# Altium schematic sheet 5v.SchDoc: Fuente Lineal 5v 10A
size A4; DrawnBy: Erick; Organization: ESIME; Revision: 1
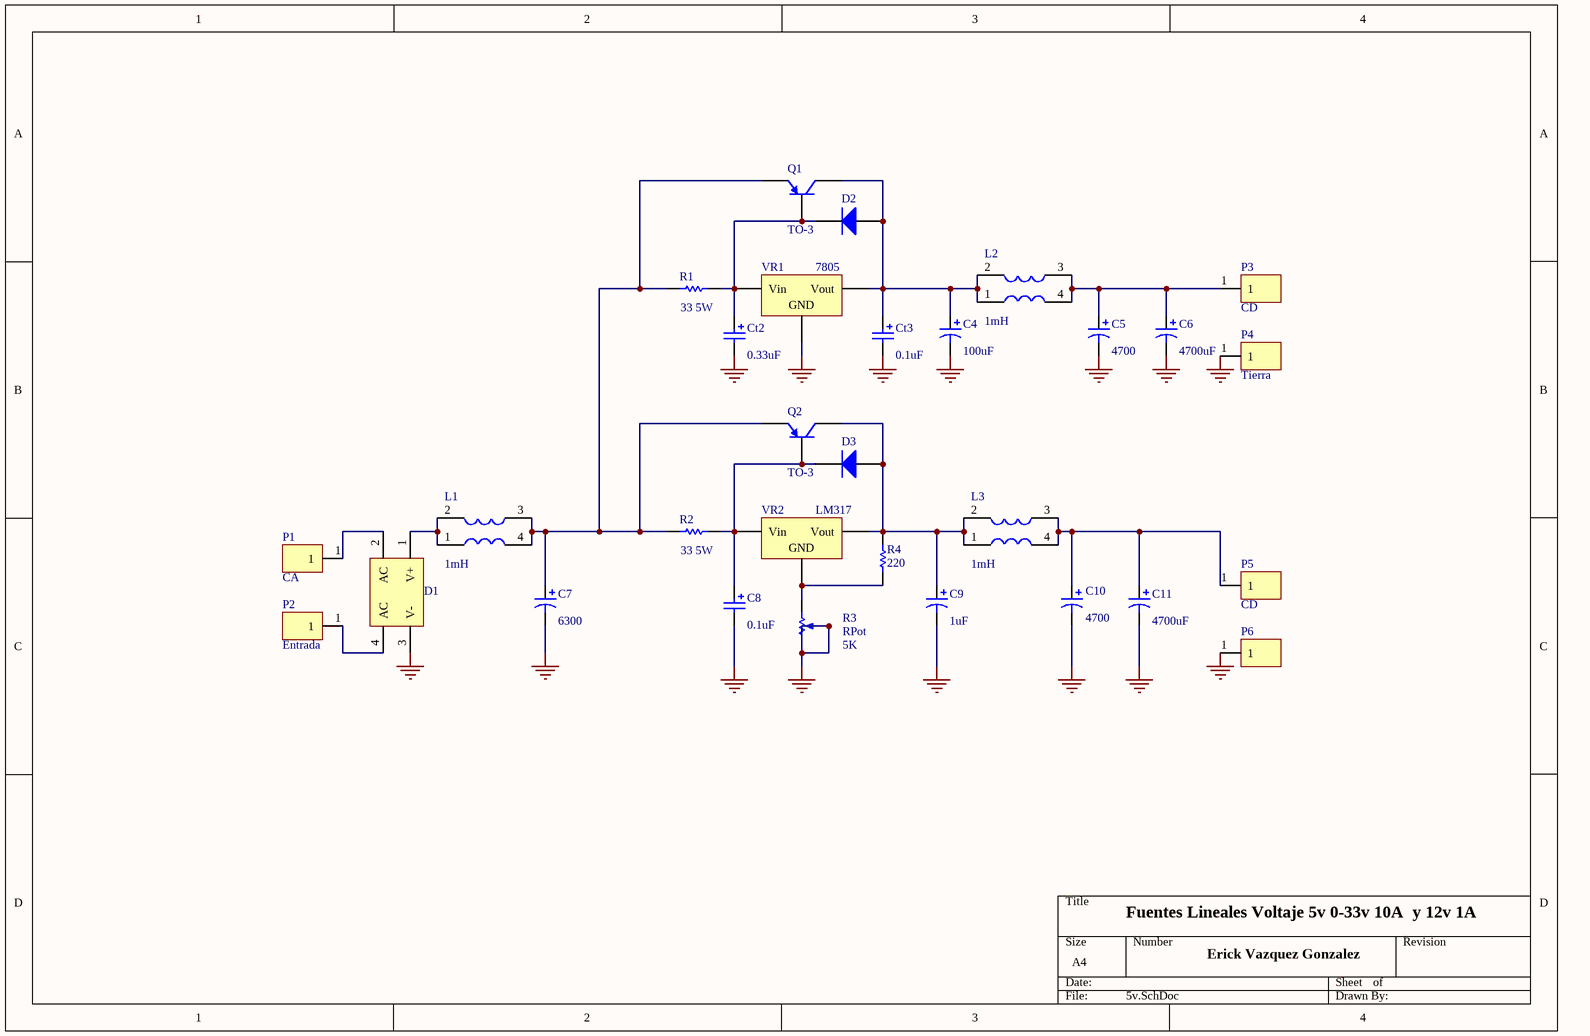
[diagram p0: 5v.SchDoc]

## Parts
C4  value 100uF  [RAD-0.2]  (hidden comment: Cap Pol2)
C5  value 4700  [CAP4700]  (hidden comment: Cap Pol1)
C6  value 4700uF  [CAP4700]  (hidden comment: Cap Pol1)
C7  value 6300  [Cap6800u]  (hidden comment: Cap Pol1)
C8  value 0.1uF  [RAD-0.2]  (hidden comment: Cap Tan)
C9  value 1uF  [RAD-0.2]  (hidden comment: Cap Pol2)
C10  value 4700  [CAP4700]  (hidden comment: Cap Pol1)
C11  value 4700uF  [CAP4700]  (hidden comment: Cap Pol1)
Ct2  value 0.33uF  [RAD-0.2]  (hidden comment: Cap Tan)
Ct3  value 0.1uF  [RAD-0.2]  (hidden comment: Cap Tan)
D1  Bridge2  [PCBComponent_1]  (value not drawn)
D2  Diodo  [SuperDiodo]  (value not drawn)
D3  Diodo  [SuperDiodo]  (value not drawn)
L1  1mH  [Bobina]
L2  1mH  [Bobina]
L3  1mH  [Bobina]
P1  CA  [MOLEX]
P2  Entrada  [MOLEX]
P3  CD  [MOLEX]
P4  Tierra  [MOLEX]
P5  CD  [MOLEX]
P6  (no value)  [MOLEX]
Q1  TO-3  [to3]
Q2  TO-3  [to3]
R1  value 33 5W  [Resist 10W]  (hidden comment: Res111)
R2  33 5W  [Resist 10W]
R3  RPot  value 5K  [POT2]
R4  value 220  [AXIAL-0.3]  (hidden comment: Res1)
VR1  7805  [HEATSINK]
VR2  LM317  [HEATSINK]

## Nets
GND: C4.2 C5.2 C6.2 C7.2 C8.2 C9.2 C10.2 C11.2 Ct2.2 Ct3.2 D1.3(V-) P4.1 P6.1 R3.1(TOP) R3.3(TAP) VR1.2(GND)
NetC4_1: C4.1 Ct3.1 D2.1(A) L2.1 L2.2 Q1.1(C) VR1.3(Vout)
NetC5_1: C5.1 C6.1 L2.3 L2.4 P3.1
NetC7_1: C7.1 L1.3 L1.4 Q1.3(E) Q2.3(E) R1.1 R2.1
NetC8_1: C8.1 D3.2(K) Q2.2(B) R2.2 VR2.1(Vin)
NetC9_1: C9.1 D3.1(A) L3.1 L3.2 Q2.1(C) R4.2 VR2.3(Vout)
NetC10_1: C10.1 C11.1 L3.3 L3.4 P5.1
NetCt2_1: Ct2.1 D2.2(K) Q1.2(B) R1.2 VR1.1(Vin)
NetD1_1: D1.1(V+) L1.1 L1.2
NetD1_2: D1.2(AC) P1.1
NetD1_4: D1.4(AC) P2.1
NetR3_2: R3.2(BOT) R4.1 VR2.2(GND)

## Notes on the sheet
- Fuentes Lineales Voltaje 5v 0-33v 10A  y 12v 1A
- Erick Vazquez Gonzalez

## Library data of the parts
C4-C7 C9-C11 = Cap Pol1: Polarized Capacitor (Radial); Published: 8-Jun-2000; LatestRevisionDate: 17-Jul-2002; LatestRevisionNote: Re-released for DXP Platform.; PackageReference: RB7.6-15; Publisher: Altium Limited; PackageDescription: Polarized Capacitor (Radial); 2 Leads
C8 Ct2 Ct3 = Cap Pol2: Polarized Capacitor (Axial); Published: 8-Jun-2000; LatestRevisionDate: 17-Jul-2002; LatestRevisionNote: Re-released for DXP Platform.; PackageReference: POLAR0.8; Publisher: Altium Limited; PackageDescription: Polarized Capacitor; 2 Leads
D1 = Bridge2: Diode Bridge; Published: 24-Mar-1999; LatestRevisionDate: 17-Jul-2002; LatestRevisionNote: Re-released for DXP Platform.; PackageReference: D-46_6A; Publisher: Altium Limited; PackageDescription: Bridge Rectifier; 4 Terminals; Body 16.8 x 16.8 mm (typ); Pitch 10.67 mm
D2 D3 = Diode 1N5408: 3 Amp Medium Power Silicon Rectifier Diode; Published: 8-Jun-2000; LatestRevisionDate: 17-Jul-2002; LatestRevisionNote: Re-released for DXP Platform.; DatasheetVersion: Aug-1984; PackageReference: DO-201AD; Publisher: Altium Limited; PackageDescription: Diode, Axial; Body 9.5 x 5.3 mm (LxDia. max), Lead Dia. 1.32 mm (max); ComponentLink1Description: Manufacturer Link; ComponentLink1URL: http://www.irf.com/
L1-L3 = Bobina
P1-P6 = Component_1
Q1 Q2 = PNP: PNP Bipolar Transistor; Published: 8-Jun-2000; LatestRevisionDate: 29-May-2009; LatestRevisionNote: IPC-7351 Footprint Added.; PackageVersion: Aug-1999; PackageReference: SOT-23B; Publisher: Altium Limited; PackageDescription: 3-Pin SOT-23 Package 0.95 mm Pitch, 2.4 mm Lead Span
R1 R2 R4 = Res1: Resistor; Published: 8-Jun-2000; LatestRevisionDate: 17-Jul-2002; LatestRevisionNote: Re-released for DXP Platform.; PackageReference: AXIAL-0.3; Publisher: Altium Limited; PackageDescription: Axial Device, Thru-Hole; 2 Leads; 0.3 in Pin Spacing
  R2: R2: 33 5W
R3 = RPot: Potentiometer; Sim Note: Enter the Resistance value and the set point into parameter fields.; Set Position: 0.5; Published: 8-Jun-2000; LatestRevisionDate: 17-Jul-2002; LatestRevisionNote: Re-released for DXP Platform.; PackageReference: VR5; Publisher: Altium Limited; PackageDescription: Variable Resistor, Thru-Hole; 3 Leads
VR1 = Volt Reg: Voltage Regulator; Published: 24-Mar-1999; LatestRevisionDate: 29-May-2009; LatestRevisionNote: IPC-7351 Footprint Added.; PackageReference: D2PAK; Publisher: Altium Limited; PackageDescription: 3-Pin Transistor Outline Package 2.54 mm Pitch, 15.1 mm Lead Span
VR2 = Volt Reg: Voltage Regulator; pin to pad: 1>3 2>1 3>2; Published: 24-Mar-1999; LatestRevisionDate: 29-May-2009; LatestRevisionNote: IPC-7351 Footprint Added.; PackageReference: D2PAK; Publisher: Altium Limited; PackageDescription: 3-Pin Transistor Outline Package 2.54 mm Pitch, 15.1 mm Lead Span